# Altium schematic sheet DAC.SchDoc: DAC for DRVs Current Limiting
size 292 x 193 mm; CheckedBy: Łukasz Gójski; Author: Jakub Howorus; CompanyName: Politechnika Warszawska; DrawnBy: Jakub Howorus; Organization: EITI; Address1: Nowowiejska 15/19; Address2: 00-665 Warszawa; SheetNumber: 13; SheetTotal: 13; HTTPLink: www.pw.edu.pl
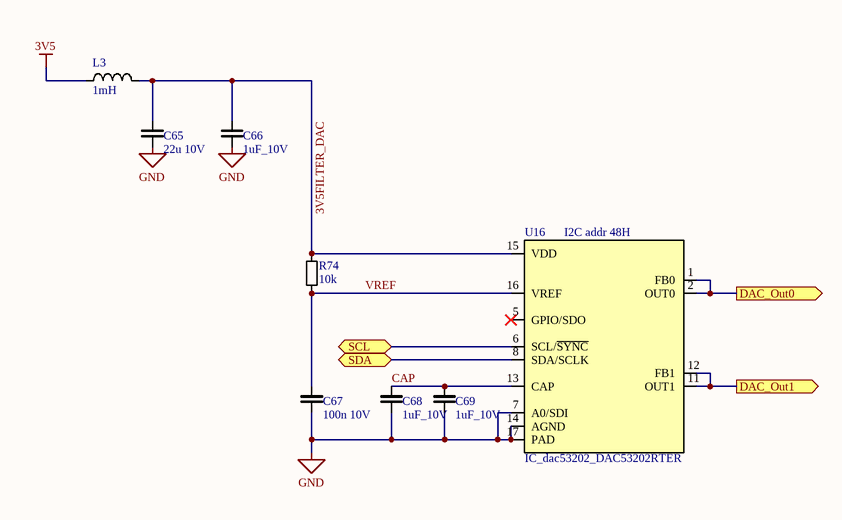
[diagram p0: DAC.SchDoc]

## Parts
C65  22u 10V  [C_1206]
C66  1uF_10V  [C_0603]
C67  100n 10V  [C_0603]
C68  1uF_10V  [C_0603]
C69  1uF_10V  [C_0603]
L3  1mH  [L_1007]
R74  10k  [R_0603]
U16  IC_dac53202_DAC53202RTER  [DAC53202_RTE0016C]

## Ports
DAC_Out0 (out, see PowerOutputsAssembly[2A]), DAC_Out1 (out, see PowerOutputsAssembly[2A]), SCL (bidir, see PowerOutputsAssembly[1A], ADCHighVoltageInputsSchDoc[2A], DCDCreg[2C], GPIOExpander[2B], PWMExpander[2B], USBPD[4C]), SDA (bidir, see PowerOutputsAssembly[1A], ADCHighVoltageInputsSchDoc[2A], DCDCreg[2C], GPIOExpander[2B], PWMExpander[2A], USBPD[4C])

## Nets
3V5: L3.1
GND: C65.1 C66.1 C67.1 C68.1 C69.1 U16.7(A0/SDI) U16.14(AGND) U16.17(PAD)
3V5FILTER_DAC: C65.2 C66.2 L3.2 R74.2 U16.15(VDD)
CAP: C68.2 C69.2 U16.13(CAP)
DAC_Out0: U16.1(FB0) U16.2(OUT0) ; port DAC_Out0
DAC_Out1: U16.11(OUT1) U16.12(FB1) ; port DAC_Out1
SCL: U16.6(SCL/~{SYNC}) ; port SCL
SDA: U16.8(SDA/SCLK) ; port SDA
VREF: C67.2 R74.1 U16.16(VREF)

Not connected (* = marked no-connect by the designer): U16 3(NC) 4(NC) 5(GPIO/SDO)* 9(NC) 10(NC)

## Notes on the sheet
- (near U16) I2C addr 48H
- Data:
- Tytuł:
- Rev.:
- Rozm.:
- A4
- Strona:
- z
- PBL4
- Opracował:
- Sprawdził:

## Library data of the parts
C65 = C_22uF_10V: Ceramic capacitor; Casing: 1206; Dielectric: X5R; Tolerance: 20%; Value: 22u; Voltage: 10V; Technology: Ceramic
C66 C68 C69 = C_1uF_10V: Ceramic capacitor; Value: 1u; Voltage: 10V; Casing: 0603; Dielectric: X7R; Tolerance: 10%; Technology: Ceramic
C67 = C_100nF_10V: Ceramic capacitor; Casing: 0603; Dielectric: X7R; Tolerance: 10%; Value: 100n; Voltage: 10V; Technology: Ceramic
L3 = L_1mH: Inductor; Casing: 1007; Tolerance: 20%; Idc: 15mA; Value: 1mH
R74 = R_10k: Resistor; Tolerance: 1%; Power: 100mW; Casing: 0603; Value: 10k
U16 = IC_dac53202_DAC53202RTER: DAC53202RTER; Manufacturer: Texas Instruments